# EAGLE design TestFichierGerber1 (EAGLE 9.5.2)
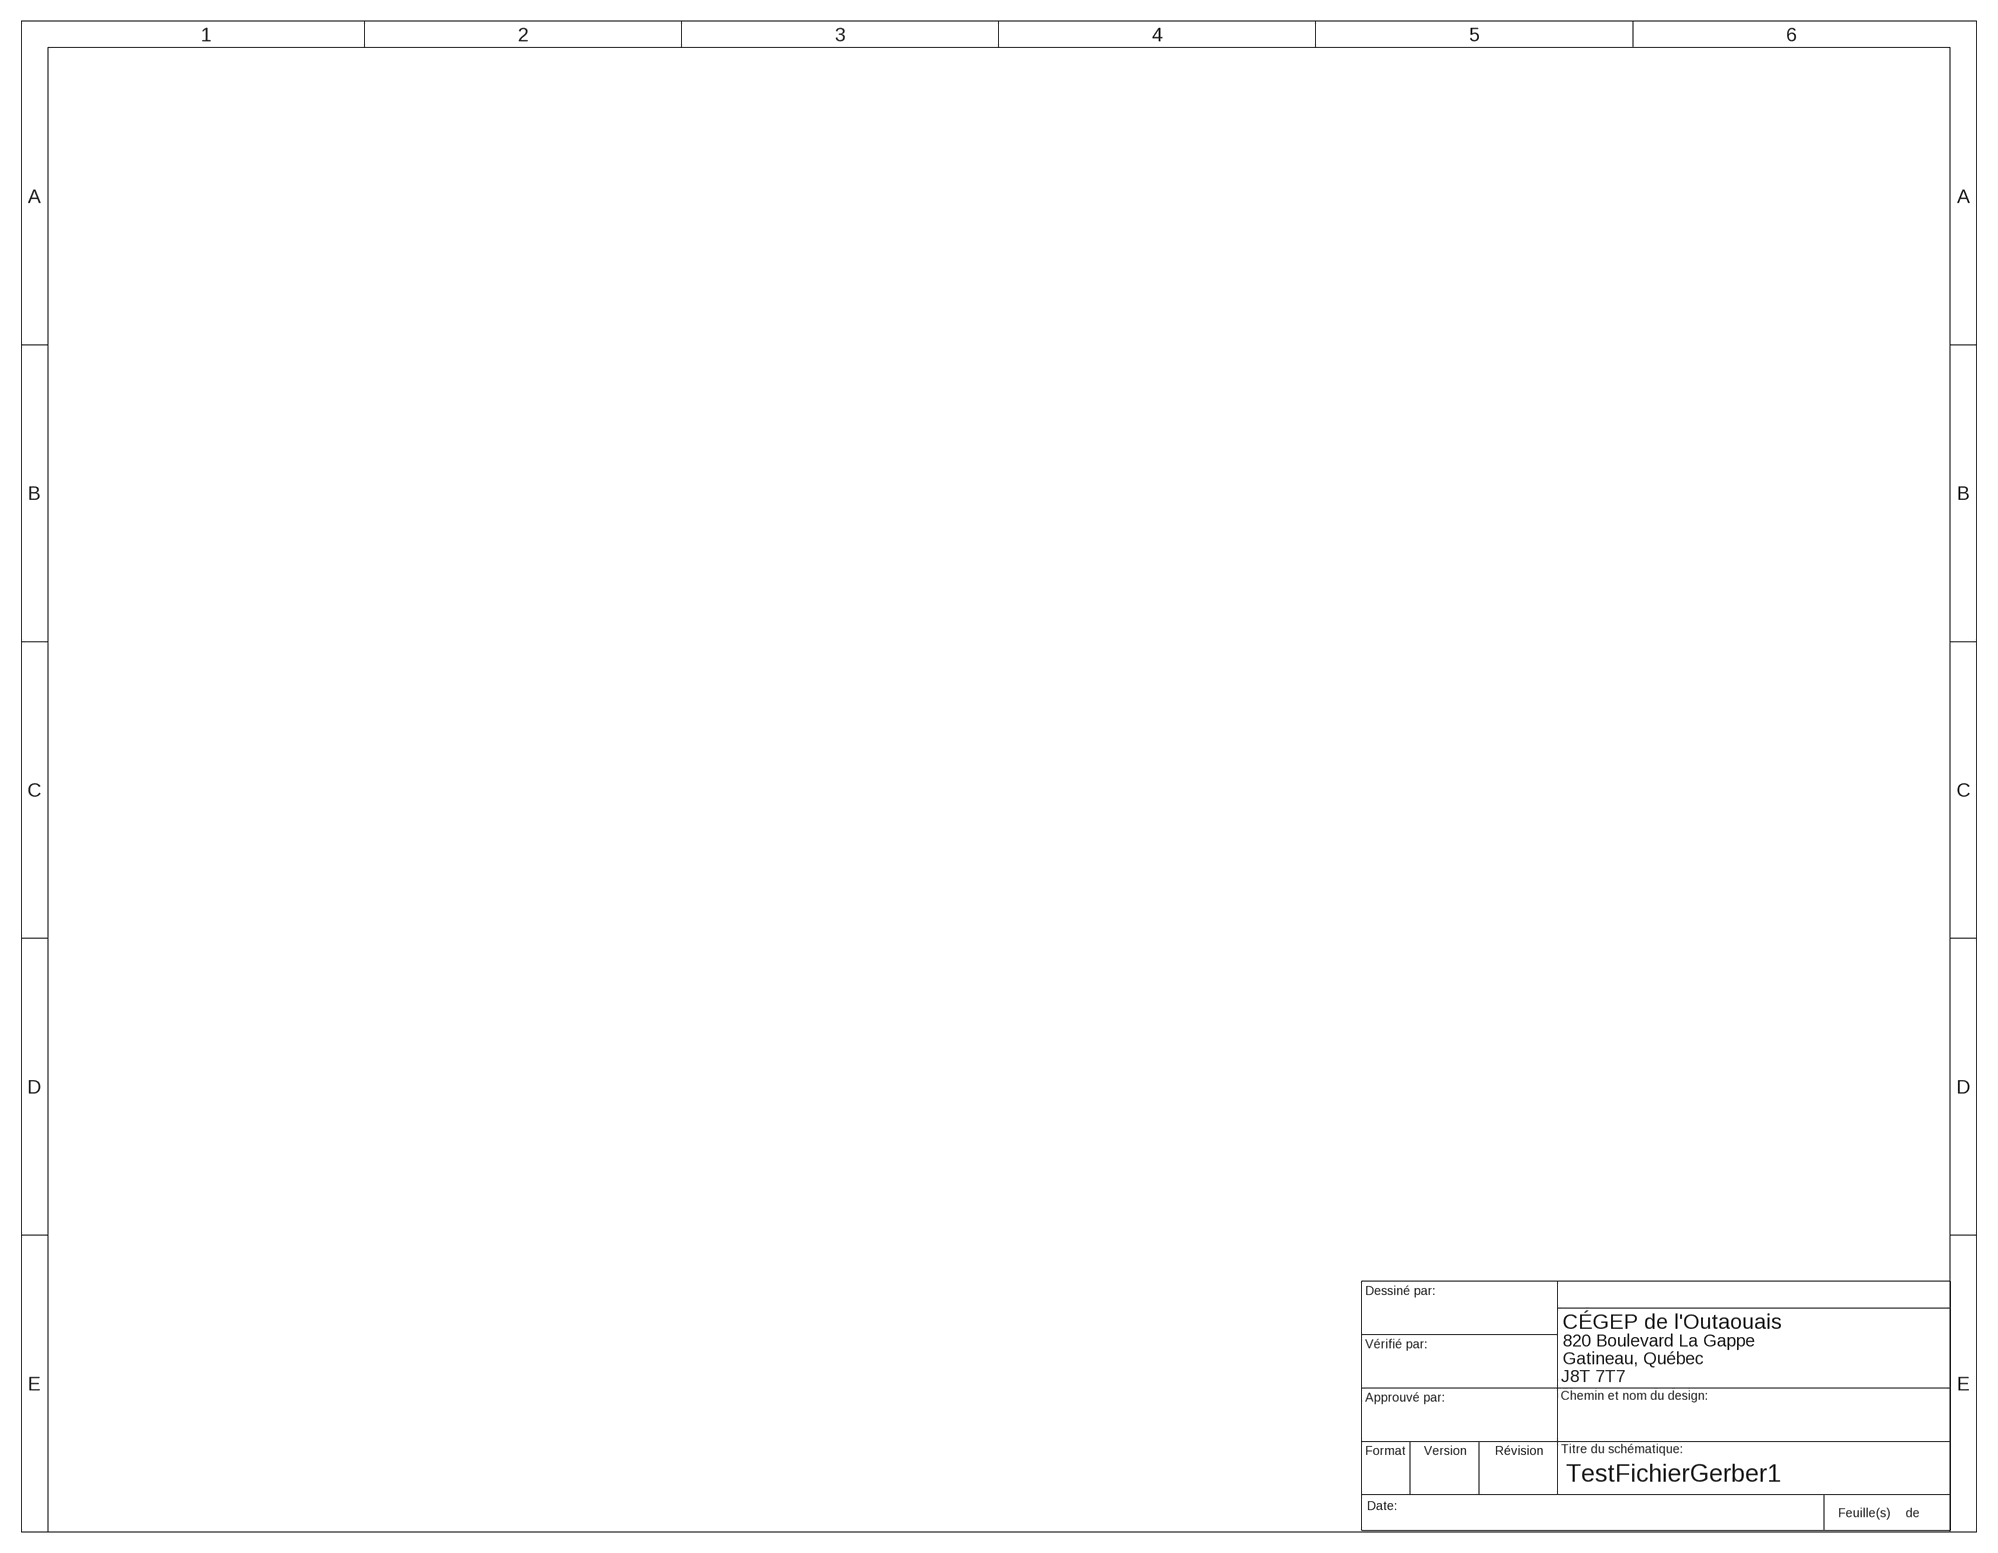
[diagram p0: schematic, sheet 1]

## Parts
FRAME1  CARTOUCHE_TGÉ  [CARTOUCHE]

## Library data of the parts
FRAME1 = 1_TGE-sur G:CARTOUCHE_TGÉ: Cartouche de TGÉ: Grandeur A, dimention 8 1/2 x 11 pouces, orientation portrait. Les élèves doivent utiliser la commande TEXT pour placer les valeurs aux champs appropriés. Couche 100 Cartouche, ne pas oublier de créer cette couche! Size par défaut: 0,07 ou ajusté en conséquence si pas asez d'espace. Ratio: 8% Font: Vector. Voir la commande TEXT pour plus d'information.

## Board
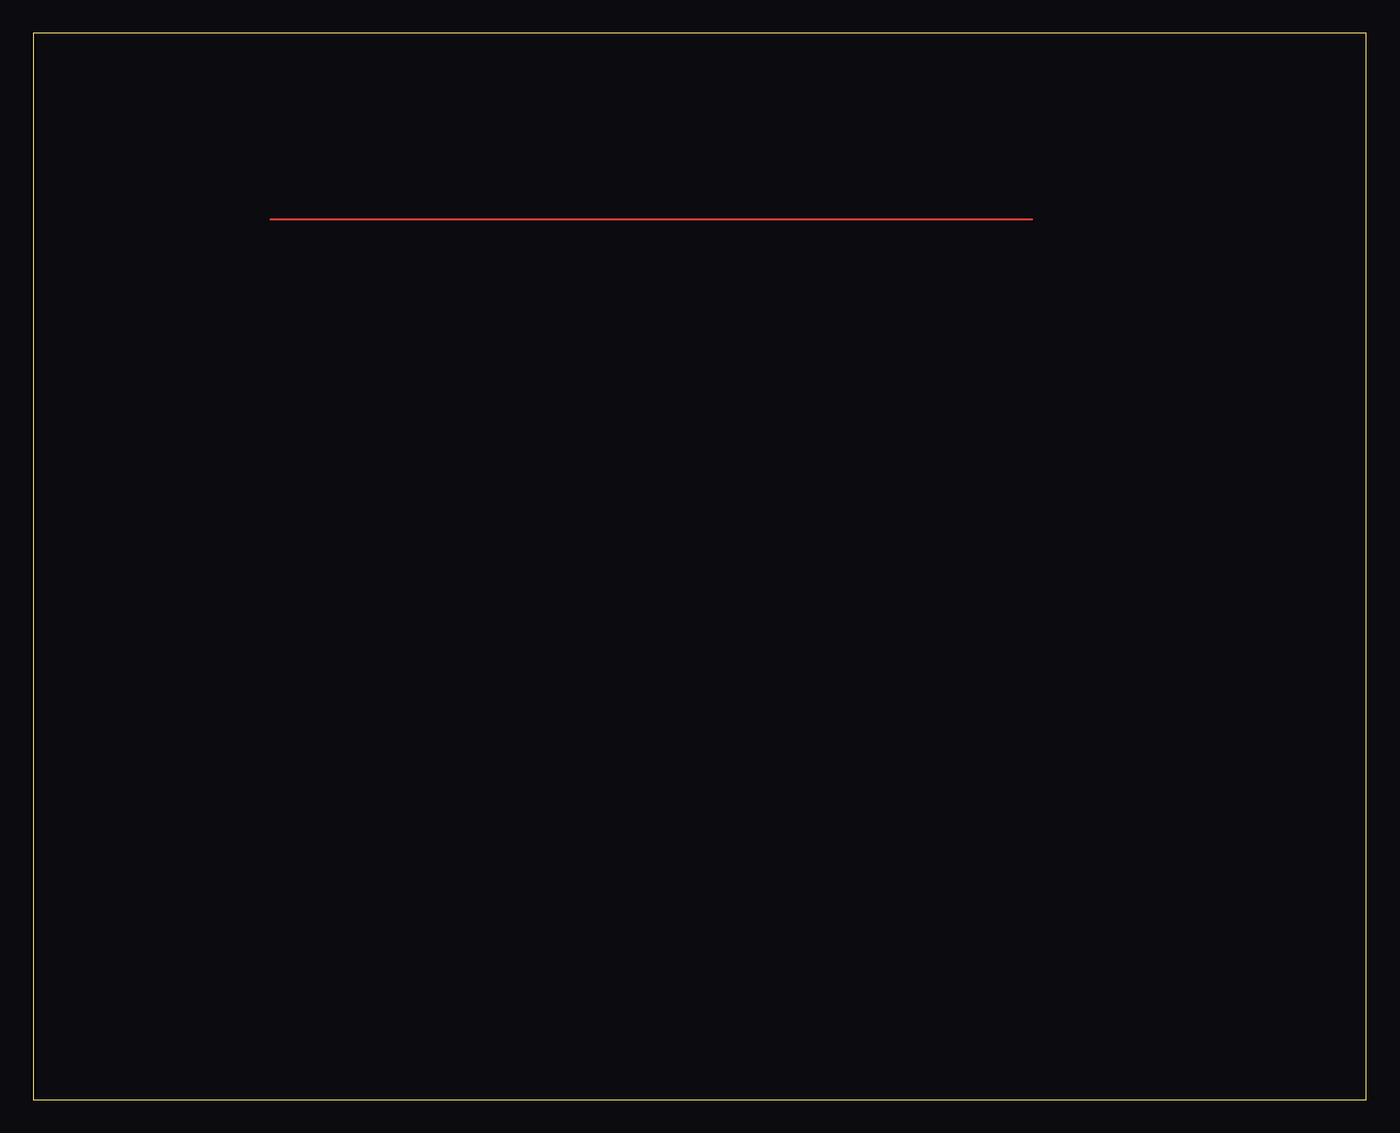
[diagram p1: board, top side]

Size 100 x 80 mm. Coordinates in mm from the lower left corner, seen from the top.
Outline: 0,0 100,0 100,80 0,80 0,0
Copper layers (1*16): Top 0.035mm / dielectric 1.5mm / Bottom 0.035mm
Design rules "default": minimum track width 6mil, minimum drill 0.35mm, track to track 6mil, track to pad 6mil, pad to pad 6mil, via to via 6mil, smd to smd 6mil, copper to edge 40mil, drill to drill 6mil, minimum pad ring 10mil, minimum via ring 8mil, stop-mask expansion 4mil, vias tented up to drill 0mil, thermal gap 10mil

### Placement (x,y rotation side)
FRAME1  -97.79,-85.09 0 top  (outside the outline)

### Tracks (layer width: path | path; a pad name or v marks a point on that pad's centre or on a via)
N$1
  Top 0.152: 17.78,66.04 74.93,66.04